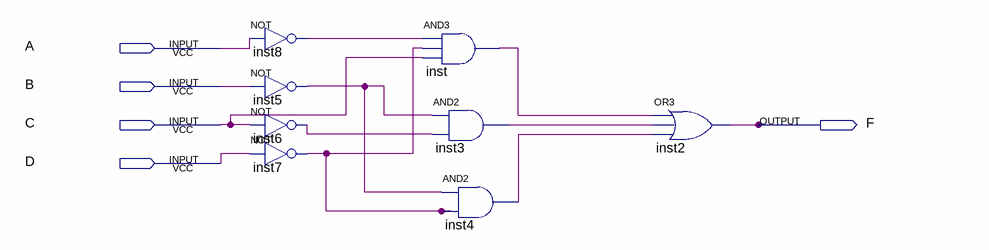
[diagram p0: schematic sheet]
// Quartus schematic ejercicio9.bdf as structural Verilog: 8 symbols, 5 pins
module ejercicio9 (
  input  A,
  input  B,
  input  C,
  input  D,
  output F
);

  wire inst3_out, inst4_out, inst5_out, inst6_out, inst7_out, inst8_out, inst_out;

  not inst8 (inst8_out, A);
  not inst5 (inst5_out, B);
  not inst6 (inst6_out, C);
  not inst7 (inst7_out, D);
  and inst (inst_out, inst8_out, inst7_out, C);
  and inst3 (inst3_out, inst5_out, inst6_out);
  and inst4 (inst4_out, inst5_out, inst7_out);
  or inst2 (F, inst_out, inst3_out, inst4_out);
endmodule
